# EAGLE design i2clight manual route (EAGLE 6.4)
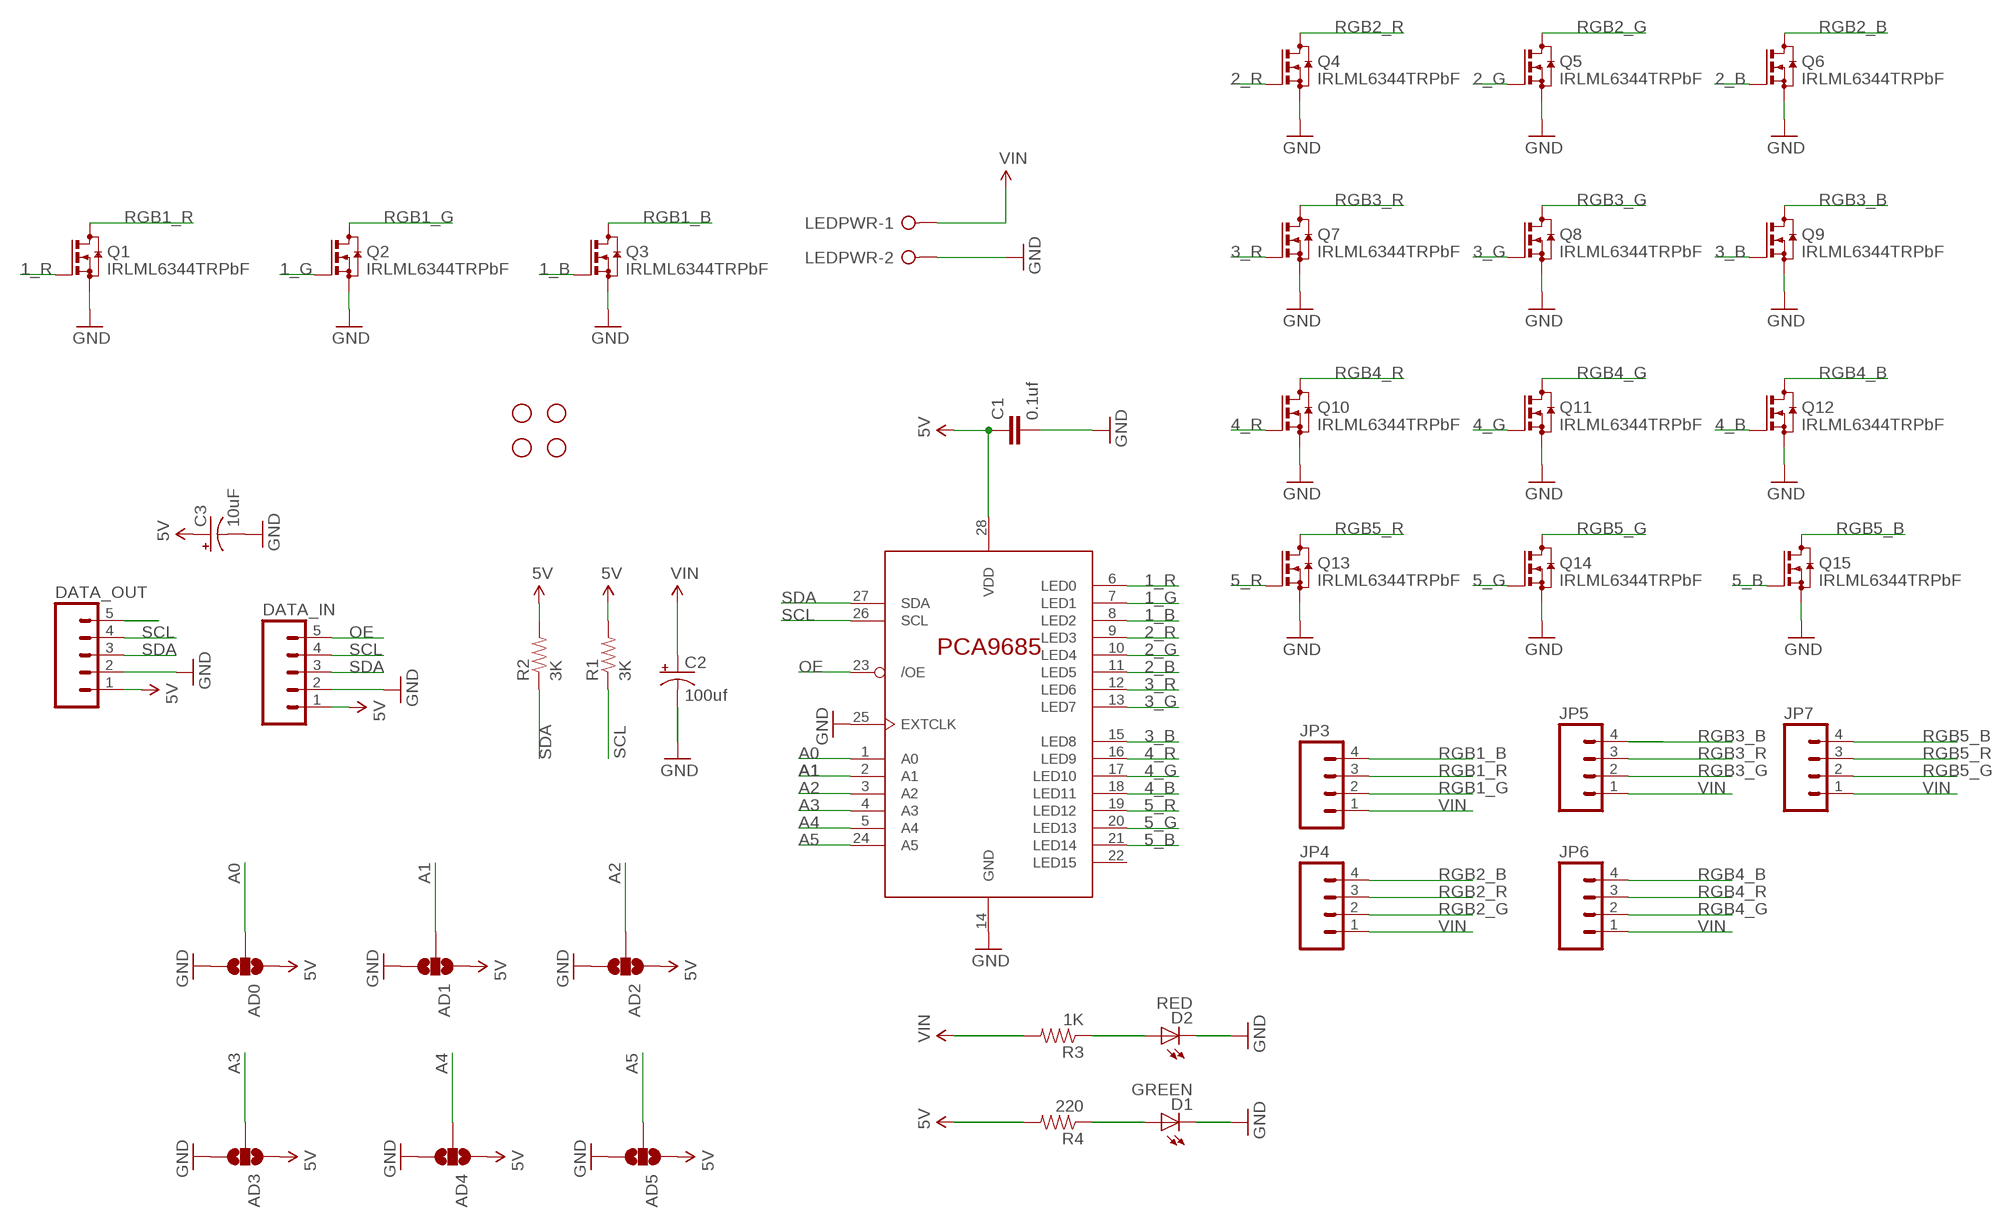
[diagram p0: schematic, sheet 1]

## Parts
AD0  SOLDERJUMPER_2WAYT  [SJ_2]
AD1  SOLDERJUMPER_2WAYT  [SJ_2]
AD2  SOLDERJUMPER_2WAYT  [SJ_2]
AD3  SOLDERJUMPER_2WAYT  [SJ_2]
AD4  SOLDERJUMPER_2WAYT  [SJ_2]
AD5  SOLDERJUMPER_2WAYT  [SJ_2]
C1  0.1uf  CAP0805  [0805]
C2  100uf  CAP_POLPTH1  [CPOL-RADIAL-100UF-25V]
C3  10uF  CAP_POLPTH2  [CPOL-RADIAL-10UF-25V]
D1  GREEN  LED-GREENLARGE  [LED-1206]
D2  RED  LED-RED1206  [LED-1206]
DATA_IN  M05PTH_LONGPADS  [1X05_LONGPADS]
DATA_OUT  M05PTH_LONGPADS  [1X05_LONGPADS]
JP3  M04POLAR  [MOLEX-1X4]
JP4  M04POLAR  [MOLEX-1X4]
JP5  M04POLAR  [MOLEX-1X4]
JP6  M04POLAR  [MOLEX-1X4]
JP7  M04POLAR  [MOLEX-1X4]
LEDPWR  W237-02P  [W237-132]
PCA9685PW  PCA9685PW  [TSSOP28]
Q1  IRLML6344TRPbF  BSS123  [SOT23]
Q2  IRLML6344TRPbF  BSS123  [SOT23]
Q3  IRLML6344TRPbF  BSS123  [SOT23]
Q4  IRLML6344TRPbF  BSS123  [SOT23]
Q5  IRLML6344TRPbF  BSS123  [SOT23]
Q6  IRLML6344TRPbF  BSS123  [SOT23]
Q7  IRLML6344TRPbF  BSS123  [SOT23]
Q8  IRLML6344TRPbF  BSS123  [SOT23]
Q9  IRLML6344TRPbF  BSS123  [SOT23]
Q10  IRLML6344TRPbF  BSS123  [SOT23]
Q11  IRLML6344TRPbF  BSS123  [SOT23]
Q12  IRLML6344TRPbF  BSS123  [SOT23]
Q13  IRLML6344TRPbF  BSS123  [SOT23]
Q14  IRLML6344TRPbF  BSS123  [SOT23]
Q15  IRLML6344TRPbF  BSS123  [SOT23]
R1  3K  RESISTOR0805-RES  [0805]
R2  3K  RESISTOR0805-RES  [0805]
R3  1K  RESISTOR0805-RES  [0805]
R4  220  RESISTOR0805-RES  [0805]
STANDOFF1  STAND-OFF  [STAND-OFF]
STANDOFF2  STAND-OFF  [STAND-OFF]
STANDOFF3  STAND-OFF  [STAND-OFF]
STANDOFF4  STAND-OFF  [STAND-OFF]

## Nets
1_B: PCA9685PW.8(LED2) Q3.1(G)
1_G: PCA9685PW.7(LED1) Q2.1(G)
1_R: PCA9685PW.6(LED0) Q1.1(G)
2_B: PCA9685PW.11(LED5) Q6.1(G)
2_G: PCA9685PW.10(LED4) Q5.1(G)
2_R: PCA9685PW.9(LED3) Q4.1(G)
3_B: PCA9685PW.15(LED8) Q9.1(G)
3_G: PCA9685PW.13(LED7) Q8.1(G)
3_R: PCA9685PW.12(LED6) Q7.1(G)
4_B: PCA9685PW.18(LED11) Q12.1(G)
4_G: PCA9685PW.17(LED10) Q11.1(G)
4_R: PCA9685PW.16(LED9) Q10.1(G)
5_B: PCA9685PW.21(LED14) Q15.1(G)
5_G: PCA9685PW.20(LED13) Q14.1(G)
5_R: PCA9685PW.19(LED12) Q13.1(G)
5V: AD0.1 AD1.1 AD2.1 AD3.1 AD4.1 AD5.1 C1.1 C3.1(+) DATA_IN.1 DATA_OUT.1 PCA9685PW.28(VDD) R1.2 R2.2 R4.2
A0: AD0.2 PCA9685PW.1(A0)
A1: AD1.2 PCA9685PW.2(A1)
A2: AD2.2 PCA9685PW.3(A2)
A3: AD3.2 PCA9685PW.4(A3)
A4: AD4.2 PCA9685PW.5(A4)
A5: AD5.2 PCA9685PW.24(A5)
GND: AD0.3 AD1.3 AD2.3 AD3.3 AD4.3 AD5.3 C1.2 C2.2(-) C3.2(-) D1.C D2.C DATA_IN.2 DATA_OUT.2 LEDPWR.2 PCA9685PW.14(GND) PCA9685PW.25(EXTCLK) Q1.2(S) Q2.2(S) Q3.2(S) Q4.2(S) Q5.2(S) Q6.2(S) Q7.2(S) Q8.2(S) Q9.2(S) Q10.2(S) Q11.2(S) Q12.2(S) Q13.2(S) Q14.2(S) Q15.2(S)
N$1: D2.A R3.1
N$2: D1.A R4.1
OE: DATA_IN.5 DATA_OUT.5 PCA9685PW.23(/OE)
RGB1_B: JP3.4 Q3.3(D)
RGB1_G: JP3.2 Q2.3(D)
RGB1_R: JP3.3 Q1.3(D)
RGB2_B: JP4.4 Q6.3(D)
RGB2_G: JP4.2 Q5.3(D)
RGB2_R: JP4.3 Q4.3(D)
RGB3_B: JP5.4 Q9.3(D)
RGB3_G: JP5.2 Q8.3(D)
RGB3_R: JP5.3 Q7.3(D)
RGB4_B: JP6.4 Q12.3(D)
RGB4_G: JP6.2 Q11.3(D)
RGB4_R: JP6.3 Q10.3(D)
RGB5_B: JP7.4 Q15.3(D)
RGB5_G: JP7.2 Q14.3(D)
RGB5_R: JP7.3 Q13.3(D)
SCL: DATA_IN.4 DATA_OUT.4 PCA9685PW.26(SCL) R1.1
SDA: DATA_IN.3 DATA_OUT.3 PCA9685PW.27(SDA) R2.1
VIN: C2.1(+) JP3.1 JP4.1 JP5.1 JP6.1 JP7.1 LEDPWR.1 R3.2
Unconnected: PCA9685PW.22(LED15)

## Library data of the parts
AD0 AD1-AD5 = SparkFun-Passives:SOLDERJUMPER_2WAY: Solder Jumper 2 way solder jumper
C1 = SparkFun-Capacitors:CAP: Capacitor Standard 0603 ceramic capacitor, and 0.1" leaded capacitor.
C2 C3 = SparkFun-Capacitors:CAP_POL: Capacitor Polarized These are standard SMD and PTH capacitors. Normally 10uF, 47uF, and 100uF in electrolytic and tantalum varieties. Always verify the external diameter of the through hole cap, it varies with capacity, voltage, and manufacturer. The EIA devices should be standard.
D1 = SparkFun-LED:LED-GREEN: Various green LEDs 0603- DIO-00821 LARGE- DIO-00862 LILYPAD- DIO-09910; PROD_ID: DIO-00862
D2 = SparkFun-LED:LED-RED: Assorted Red LEDs LilyPad 1206- DIO-09912 1206- DIO-00809 0603- DIO-00819; PROD_ID: DIO-00809
DATA_IN DATA_OUT = SparkFun-Connectors:M05: Header 5 Standard 5-pin 0.1" header. Use with straight break away headers (SKU : PRT-00116), right angle break away headers (PRT-00553), swiss pins (PRT-00743), machine pins (PRT-00117), and female headers (PRT-00115). Molex polarized connector foot print use with SKU : PRT-08230 with associated crimp pins and housings.
JP3-JP7 = SparkFun-Connectors:M04: Header 4 Standard 4-pin 0.1" header. Use with straight break away headers (SKU : PRT-00116), right angle break away headers (PRT-00553), swiss pins (PRT-00743), machine pins (PRT-00117), and female headers (PRT-00115). Molex polarized connector foot print use with SKU : PRT-08231 with associated crimp pins and housings. 1MM SMD Version SKU: PRT-10208
LEDPWR = con-wago-508:W237-02P: WAGO SREW CLAMP; OC_FARNELL: unknown; OC_NEWARK: unknown
PCA9685PW = i2c-led-controller:PCA9685
Q1-Q15 = transistor-small-signal:BSS123: N-CHANNEL MOS FET
R1-R4 = SparkFun-Passives:RESISTOR: Resistor Basic schematic elements and footprints for 0603, 1206, and PTH resistors.
STANDOFF1-STANDOFF4 = SparkFun-Electromechanical:STAND-OFF: #4 Stand Off This is the mechanical footprint for a #4 phillips button head screw. Use the keepout ring to avoid running the screw head into surrounding components. SKU : PRT-00447

## Board
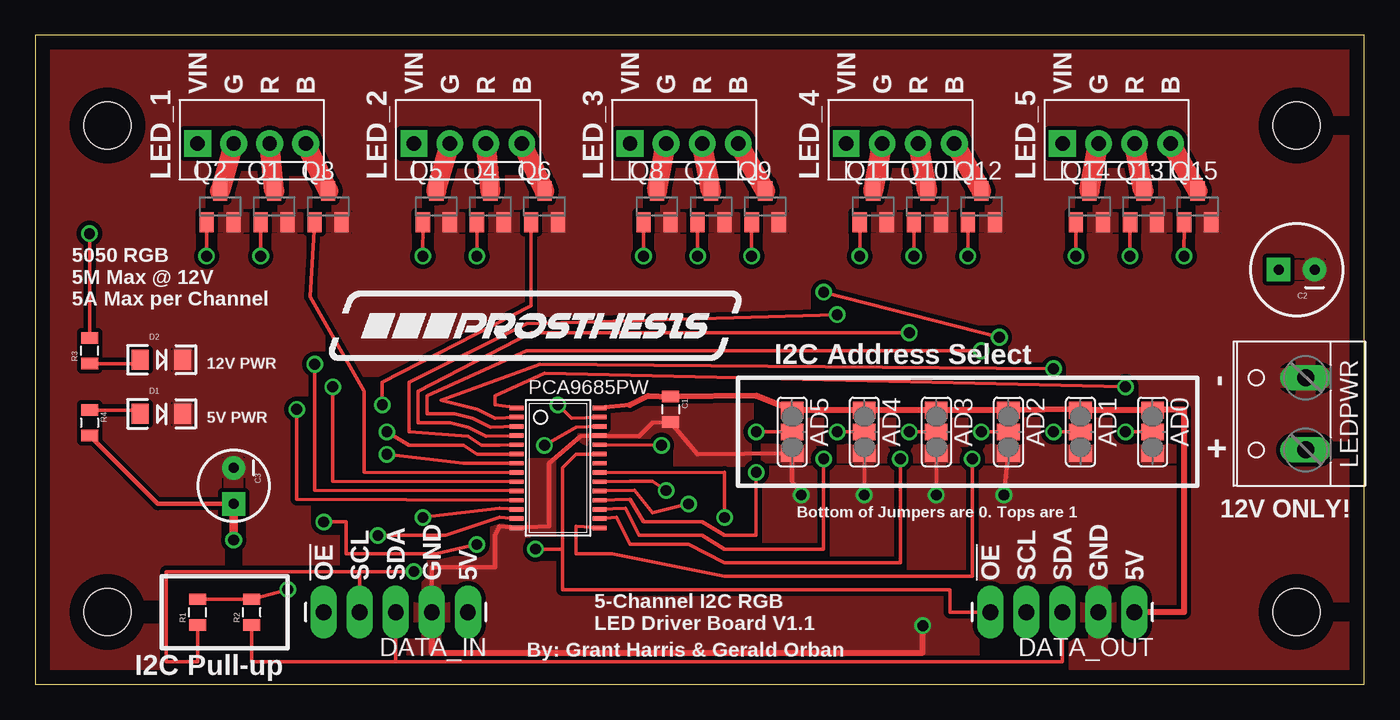
[diagram p1: board, top side]
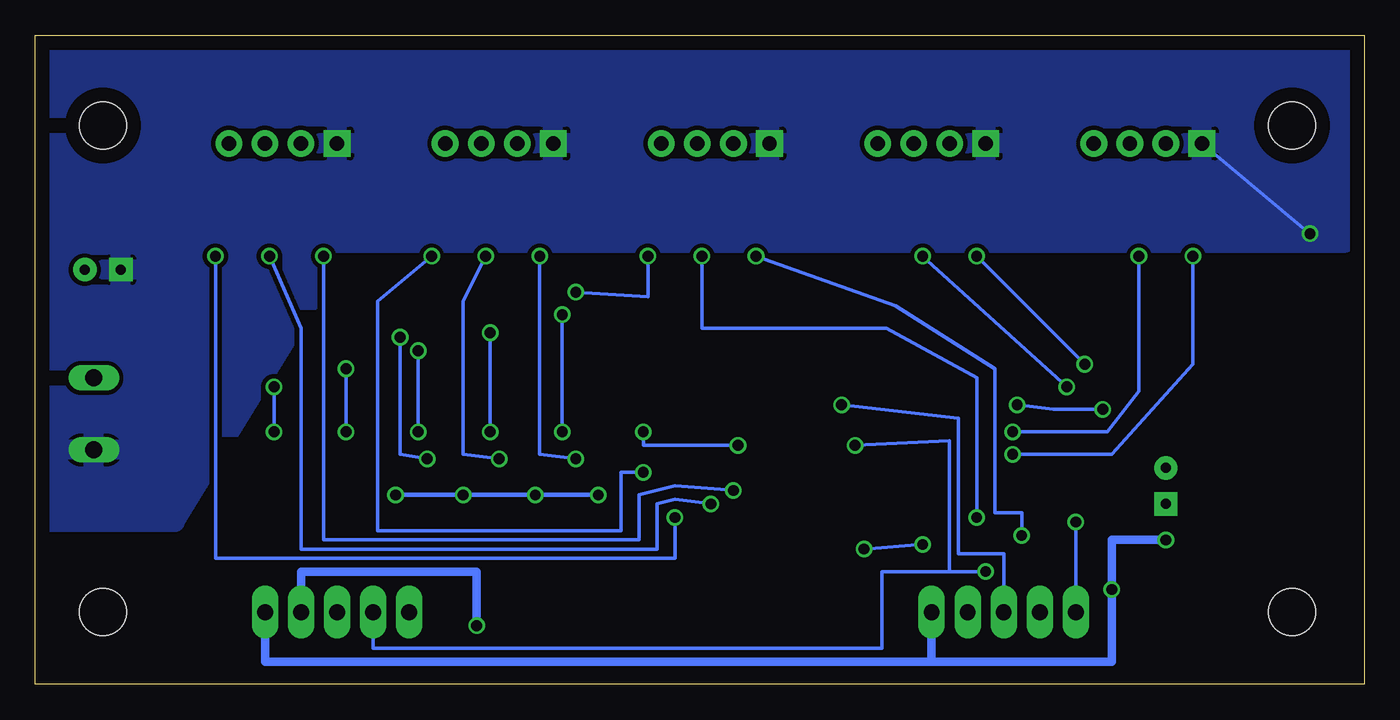
[diagram p2: board, bottom side, seen from below]

Size 93.65 x 45.71 mm. Coordinates in mm from the lower left corner, seen from the top.
Outline: 0,0 93.65,0 93.65,45.71 0,45.71 0,0
Copper layers (1*16): Top 0.035mm / dielectric 1.5mm / Bottom 0.035mm
Design rules "default *": minimum track width 10mil, minimum drill 24mil, track to track 12mil, track to pad 12mil, pad to pad 12mil, via to via 12mil, smd to smd 8mil, copper to edge 40mil, drill to drill 8mil, minimum pad ring 12mil, minimum via ring 8mil, stop-mask expansion 4mil, vias tented up to drill 0mil, thermal gap 10mil

### Footprints (pad centres in the part's own frame; a part is rotated, then mirrored left to right if it is on the bottom)
SJ_2 = smd 1.168 x 1.6: 1 -1.524,0; 2 0,0; 3 1.524,0
0805 = smd 0.8 x 1.2: 1 -0.9,0; 2 0.9,0
CPOL-RADIAL-100UF-25V = drill 0.7 pad 1.651 square: 1 1.27,0 | drill 0.7 pad 1.651: 2 -1.27,0
CPOL-RADIAL-10UF-25V = drill 0.7 pad 1.651 square: 1 1.27,0 | drill 0.7 pad 1.651: 2 -1.27,0
LED-1206 = smd 1.2 x 1.4: A -1.5,0; C 1.5,0
1X05_LONGPADS = drill 1.118 pad 1.88 long: 1 0,0; 2 2.54,0; 3 5.08,0; 4 7.62,0; 5 10.16,0
MOLEX-1X4 = drill 1.016 pad 1.88 square: 1 0,0 | drill 1.016 pad 1.88: 2 2.54,0; 3 5.08,0; 4 7.62,0
W237-132 = drill 1.194 long: 1 -2.54,-0.635; 2 2.54,-0.635
TSSOP28 = smd 0.305 x 0.991: 1 -4.225,-2.918; 2 -3.575,-2.918; 3 -2.925,-2.918; 4 -2.275,-2.918; 5 -1.625,-2.918; 6 -0.975,-2.918; 7 -0.325,-2.918; 8 0.325,-2.918; 9 0.975,-2.918; 10 1.625,-2.918; 11 2.275,-2.918; 12 2.925,-2.918; 13 3.575,-2.918; 14 4.225,-2.918; 15 4.225,2.918; 16 3.575,2.918; 17 2.925,2.918; 18 2.275,2.918; 19 1.625,2.918; 20 0.975,2.918; 21 0.325,2.918; 22 -0.325,2.918; 23 -0.975,2.918; 24 -1.625,2.918; 25 -2.275,2.918; 26 -2.925,2.918; 27 -3.575,2.918; 28 -4.225,2.918
SOT23 = smd 1 x 1.4: 1 -0.95,-1.1; 2 0.95,-1.1; 3 0,1.1
STAND-OFF = hole 3.302: 0,0

### Placement (x,y rotation side)
AD0  78.74,17.78 270 top
AD1  73.66,17.78 270 top
AD2  68.58,17.78 270 top
AD3  63.5,17.78 270 top
AD4  58.42,17.78 270 top
AD5  53.34,17.78 270 top
C1  44.77,19.37 270 top
C2  88.9,29.21 180 top
C3  13.97,13.97 270 top
D1  8.89,19.05 0 top
D2  8.89,22.86 0 top
DATA_IN  30.48,5.08 180 top
DATA_OUT  77.47,5.08 180 top
JP3  11.43,38.1 0 top
JP4  26.67,38.1 0 top
JP5  41.91,38.1 0 top
JP6  57.15,38.1 0 top
JP7  72.39,38.1 0 top
LEDPWR  88.9,19.05 90 top
PCA9685PW  36.83,15.24 270 top
Q1  16.83,33.66 0 top
Q2  13.02,33.66 0 top
Q3  20.64,33.66 0 top
Q4  32.07,33.66 0 top
Q5  28.26,33.66 0 top
Q6  35.88,33.66 0 top
Q7  47.62,33.66 0 top
Q8  43.81,33.66 0 top
Q9  51.44,33.66 0 top
Q10  62.87,33.66 0 top
Q11  59.05,33.66 0 top
Q12  66.67,33.66 0 top
Q13  78.11,33.66 0 top
Q14  74.3,33.66 0 top
Q15  81.92,33.66 0 top
R1  11.43,5.08 90 top
R2  15.24,5.08 90 top
R3  3.81,23.5 90 top
R4  3.81,18.41 270 top
STANDOFF1  5.08,39.37 0 top
STANDOFF2  5.08,5.08 0 top
STANDOFF3  88.9,39.37 0 top
STANDOFF4  88.9,5.08 0 top
U$2  [PROSTHESIS]  19.05,21.27 0 top

### Tracks (layer width: path | path; a pad name or v marks a point on that pad's centre or on a via)
1_B
  Top 0.254: PCA9685PW.8 23.18,14.92 23.18,20.64 19.37,27.3 Q3.1
1_G  (via drill 0.76)
  Top 0.254: PCA9685PW.7 30.16,15.56 v24.77,16.19 | v12.06,30.16 Q2.1
  Bottom 0.254: v24.77,16.19 17.78,16.19 12.06,22.54 v12.06,30.16
1_R  (via drill 0.76)
  Top 0.254: PCA9685PW.6 31.11,16.19 30.16,16.83 26.35,16.83 v24.77,17.78 | v15.88,30.16 Q1.1
  Bottom 0.254: v24.77,17.78 18.1,17.78 15.88,20.64 v15.88,30.16
2_B  (via drill 0.76 pad 0.3)
  Top 0.254: Q6.1 34.92,26.67 24.45,21.27 v24.45,19.68 | v18.41,19.37 18.41,13.02 PCA9685PW.11
  Bottom 0.254: v24.45,19.68 21.91,19.37 v18.41,19.37
2_G  (via drill 0.76 pad 0.3)
  Top 0.254: Q5.1 v27.3,30.16 | v19.68,22.54 19.68,13.65 PCA9685PW.10
  Bottom 0.254: v27.3,30.16 v19.68,22.54
2_R  (via drill 0.76 pad 0.3)
  Top 0.254: PCA9685PW.9 20.95,14.29 v20.95,20.95 | v31.11,30.16 Q4.1
  Bottom 0.254: v20.95,20.95 v31.11,30.16
3_B  (via drill 0.76 pad 0.3)
  Top 0.254: PCA9685PW.15 38.1,11.11 38.1,9.21 40.64,9.21 48.58,7.62 66.04,7.62 v66.04,15.88 | v67.94,24.45 v55.56,27.62 | v50.48,30.16 Q9.1
  Bottom 0.254: v66.04,15.88 67.94,16.19 v67.94,24.45 | v55.56,27.62 50.48,27.3 v50.48,30.16
3_G  (via drill 0.76 pad 0.3)
  Top 0.254: PCA9685PW.13 32.7,11.75 28.89,10.48 v24.13,10.48 | v42.86,30.16 Q8.1
  Bottom 0.254: v24.13,10.48 24.13,12.06 26.04,12.06 26.04,22.23 33.02,26.67 v42.86,30.16
3_R  (via drill 0.76 pad 0.3)
  Top 0.254: PCA9685PW.12 32.7,12.38 v27.3,11.75 | v46.67,30.16 Q7.1
  Bottom 0.254: v27.3,11.75 27.3,21.59 33.66,25.08 46.67,25.08 v46.67,30.16
4_B  (via drill 0.76 pad 0.3)
  Top 0.254: PCA9685PW.18 41.91,13.02 42.86,11.43 46.99,11.43 48.58,10.48 50.8,10.48 v50.8,14.92 | v65.72,30.16 Q12.1
  Bottom 0.254: v50.8,14.92 52.39,14.92 52.39,10.79 69.53,10.79 69.53,26.99 v65.72,30.16
4_G  (via drill 0.76 pad 0.3)
  Top 0.254: PCA9685PW.17 41.59,12.38 42.55,10.48 46.99,10.48 48.58,9.53 55.56,9.53 v55.56,15.88 | v58.1,30.16 Q11.1
  Bottom 0.254: v55.56,15.88 58.1,16.19 v58.1,30.16
4_R  (via drill 0.76 pad 0.3)
  Top 0.254: PCA9685PW.16 40.96,11.75 41.91,9.84 46.04,9.84 48.58,8.57 60.96,8.57 v60.96,15.88 | v61.91,30.16 Q10.1
  Bottom 0.254: v60.96,15.88 63.5,16.19 63.5,26.99 v61.91,30.16
5_B  (via drill 0.76 pad 0.3)
  Top 0.254: PCA9685PW.21 48.58,14.92 v48.58,11.75 | v80.96,30.16 Q15.1
  Bottom 0.254: v48.58,11.75 48.58,8.89 80.96,8.89 v80.96,30.16
5_G  (via drill 0.76 pad 0.3)
  Top 0.254: PCA9685PW.20 41.91,14.29 43.5,14.29 v44.45,13.65 | v73.34,30.16 Q14.1
  Bottom 0.254: v44.45,13.65 48.58,13.97 51.12,13.34 51.12,10.16 73.34,10.16 v73.34,30.16
5_R  (via drill 0.76 pad 0.3)
  Top 0.254: PCA9685PW.19 42.23,13.65 43.5,12.06 v46.04,12.7 | v77.15,30.16 Q13.1
  Bottom 0.254: v46.04,12.7 48.58,13.02 49.85,12.7 49.85,9.53 74.93,9.53 74.93,25.08 v77.15,30.16
5V  (via drill 0.76 pad 0.3)
  Top 0.254: R1.2 R2.2 v17.78,6.67 | AD1.1 73.66,19.37
  Top 0.305: PCA9685PW.28 41.91,19.68 | C3.1 8.62,12.7 R4.2
  Top 0.406: 41.91,19.68 43.18,20.32 C1.1 50.8,20.32 AD5.1 AD4.1 AD3.1 AD2.1 73.66,19.37 | AD1.1 AD0.1 78.74,19.37 80.96,19.37 80.96,5.08 DATA_OUT.1
  Top 0.61: C3.1 v13.97,10.16
  Bottom 0.61: v13.97,10.16 17.78,10.16 v17.78,6.67 17.78,1.59 30.48,1.59 | DATA_IN.1 30.48,1.59 | DATA_OUT.1 77.47,1.59 30.48,1.59
A0  (via drill 0.76 pad 0.3)
  Top 0.254: PCA9685PW.1 32.38,19.68 32.38,20.32 35.88,21.91 v76.83,20.95 | v76.83,17.78 AD0.2
  Bottom 0.254: v76.83,20.95 v76.83,17.78
A1  (via drill 0.76 pad 0.3)
  Top 0.254: PCA9685PW.2 32.38,18.73 31.11,19.37 28.57,20 35.56,22.54 v71.75,22.23 | v71.75,17.78 AD1.2
  Bottom 0.254: v71.75,22.23 v71.75,17.78
A2  (via drill 0.76 pad 0.3)
  Top 0.254: PCA9685PW.3 32.07,18.1 30.8,18.73 29.53,19.05 27.62,19.05 27.62,20.32 34.61,23.5 v66.67,23.5 | v66.67,17.78 AD2.2
  Bottom 0.254: v66.67,23.5 v66.67,17.78
A3  (via drill 0.76 pad 0.3)
  Top 0.254: PCA9685PW.4 31.75,17.46 30.48,18.1 29.21,18.41 26.99,18.41 26.99,20.64 34.92,24.77 v61.59,24.77 | v61.59,17.78 AD3.2
  Bottom 0.254: v61.59,24.77 v61.59,17.78
A4  (via drill 0.76 pad 0.3)
  Top 0.254: PCA9685PW.5 32.7,16.83 31.43,16.83 30.48,17.46 26.35,17.78 26.35,21.27 34.61,25.4 v56.52,26.04 | v56.52,17.78 AD4.2
  Bottom 0.254: v56.52,26.04 v56.52,17.78
A5  (via drill 0.76 pad 0.3)
  Top 0.254: AD5.2 v50.8,17.78 | v44.13,16.83 PCA9685PW.24
  Bottom 0.254: v50.8,17.78 50.8,16.83 v44.13,16.83
GND  (via drill 0.76 pad 0.3)
  Top 0.254: AD4.3 v58.42,13.34 | AD3.3 v63.5,13.34
  Top 0.305: DATA_IN.2 27.94,8.26 32.38,8.26 32.38,10.48 32.7,11.11 PCA9685PW.14 36.2,11.11 36.2,15.56 38.42,17.46 PCA9685PW.25 42.55,17.46 43.5,18.41 C1.2 46.67,16.19 AD5.3 53.34,14.29 v53.98,13.34 | v68.26,13.34 AD2.3
  Top 0.406: DATA_IN.2 27.94,2.22 62.55,2.22 v62.55,4.13
  Bottom 0.305: v53.98,13.34 v58.42,13.34 v63.5,13.34 v68.26,13.34
  Bottom 0.61: v62.55,4.13 62.55,7.94 74.93,7.94 DATA_OUT.2
  pour Top (isolate 0.305): 1.27,44.45 1.27,1.27 92.39,1.27 92.39,44.45
N$1
  Top 0.254: 7.17,22.64 D2.A 7.12,22.59 R3.1
N$2
  Top 0.254: 7.17,19.27 D1.A 7.12,19.32 R4.1
OE  (via drill 0.76 pad 0.3)
  Top 0.254: PCA9685PW.23 38.1,16.19 37.15,15.24 37.15,9.53 | 37.15,9.53 37.15,6.67 64.45,6.67 64.45,5.08 DATA_OUT.5 | v20.32,11.43 21.91,11.43 21.91,9.21 28.26,9.21 v31.11,9.84 | v35.24,9.53 37.15,9.53
  Bottom 0.254: DATA_IN.5 v20.32,11.43 | v31.11,9.84 v35.24,9.53
RGB1_B
  Top 1.422: Q3.3 JP3.4
RGB1_G
  Top 1.422: JP3.2 Q2.3
RGB1_R
  Top 1.422: Q1.3 JP3.3
RGB2_B
  Top 1.422: Q6.3 JP4.4
RGB2_G
  Top 1.422: Q5.3 JP4.2
RGB2_R
  Top 1.422: Q4.3 JP4.3
RGB3_B
  Top 1.422: Q9.3 JP5.4
RGB3_G
  Top 1.422: Q8.3 JP5.2
RGB3_R
  Top 1.422: Q7.3 JP5.3
RGB4_B
  Top 1.422: Q12.3 JP6.4
RGB4_G
  Top 1.422: Q11.3 JP6.2
RGB4_R
  Top 1.422: Q10.3 JP6.3
RGB5_B
  Top 1.422: Q15.3 JP7.4
RGB5_G
  Top 1.422: Q14.3 JP7.2
RGB5_R
  Top 1.422: Q13.3 JP7.3
SCL  (via drill 0.76 pad 0.3)
  Top 0.254: R1.1 11.43,1.59 9.21,1.59 9.21,7.94 22.86,7.94 | 22.86,7.94 DATA_IN.4 | PCA9685PW.26 38.1,18.1 v35.88,16.83 | v26.67,7.94 22.86,7.94
  Bottom 0.254: v35.88,16.83 29.21,17.14 29.21,7.94 | 29.21,7.94 v26.67,7.94 | DATA_OUT.4 69.85,2.54 33.97,2.54 33.97,7.94 29.21,7.94
SDA  (via drill 0.76 pad 0.3)
  Top 0.254: R2.1 15.24,1.59 25.4,1.59 | 25.4,1.59 DATA_IN.3 | PCA9685PW.27 37.78,18.73 v36.83,19.68 | DATA_OUT.3 72.39,1.59 25.4,1.59
  Bottom 0.254: v36.83,19.68 28.57,18.73 28.57,9.21 25.4,9.21 DATA_IN.3
VIN  (via drill 0.76)
  Top 0.254: R3.2 v3.81,31.75
  Bottom 0.254: v3.81,31.75 JP3.1
  pour Bottom (isolate 0.305): 93.03,11.43 83.82,11.43 71.75,31.11 1.27,31.11 1.27,44.45 92.39,44.45

### Text on the board
tNames: VIN | G | R | B | VIN | G | R | B | VIN | G | R | B | VIN | G | R | B | VIN | G | R | B | LED_1 | LED_2 | LED_3 | LED_4 | LED_5 | 5050 RGB / 5M Max @ 12V / 5A Max per Channel | I2C Address Select | 12V PWR | - | 5V PWR | + | Bottom of Jumpers are 0. Tops are 1 | 12V ONLY! | !OE | SCL | SDA | GND | 5V | !OE | SCL | SDA | GND | 5V | 5-Channel I2C RGB / LED Driver Board V1.1 | By: Grant Harris & Gerald Orban | I2C Pull-up